# EAGLE design dc-fan (EAGLE 7.7.0)
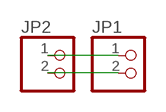
[diagram p0: schematic, sheet 1]

## Parts
JP1  PINHD-1X2-2.54MM  [1X02]
JP2  PINHD-1X2-2.54MM  [1X02]

## Nets
N$1: JP1.2 JP2.2
N$2: JP1.1 JP2.1

## Library data of the parts
JP1 JP2 = 0my:PINHD-1X2-: PIN HEADER

## Board
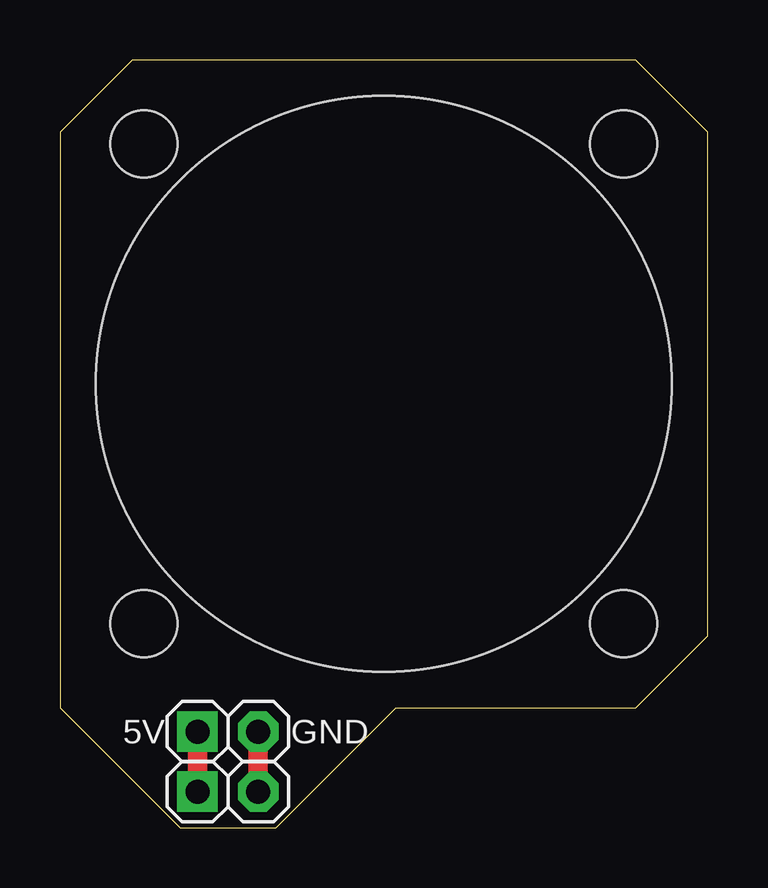
[diagram p1: board, top side]

Size 27 x 32 mm. Coordinates in mm from the lower left corner, seen from the top.
Outline: 0,29 0,5 5,0 9,0 14,5 24,5 27,8 27,29 24,32 3,32 0,29
Copper layers (1*16): Top 0.035mm / dielectric 1.5mm / Bottom 0.035mm
Design rules "default": minimum track width 10mil, minimum drill 24mil, track to track 8mil, track to pad 8mil, pad to pad 8mil, via to via 8mil, smd to smd 8mil, copper to edge 40mil, drill to drill 8mil, minimum pad ring 10mil, minimum via ring 8mil, stop-mask expansion 4mil, vias tented up to drill 0mil, thermal gap 10mil
Holes 2.8 mm at 3.5,8.5 23.5,8.5 3.5,28.5 23.5,28.5
Holes 24 mm at 13.5,18.5

### Footprints (pad centres in the part's own frame; a part is rotated, then mirrored left to right if it is on the bottom)
1X02 = drill 1 pad 1.676 square: 1 -1.27,0 | drill 1 pad 1.676 octagon: 2 1.27,0

### Placement (x,y rotation side)
JP1  7,4 0 top
JP2  7,1.5 0 top

### Tracks (layer width: path | path; a pad name or v marks a point on that pad's centre or on a via)
N$1
  Top 0.813: JP1.2 JP2.2
N$2
  Top 0.813: JP1.1 JP2.1

### Text on the board
tNames: 5V | GND
bNames: 5V | GND